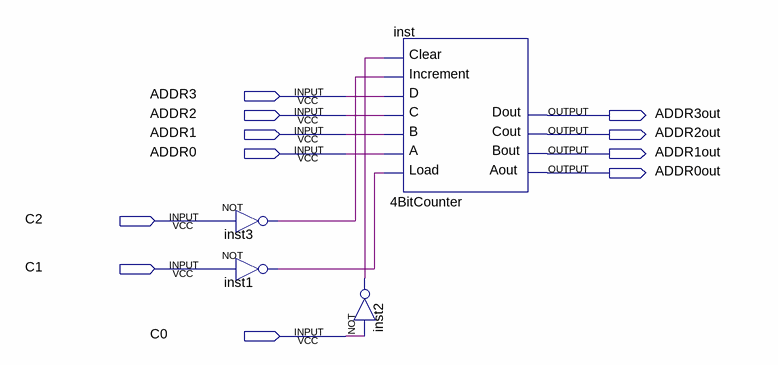
[diagram p0: schematic sheet]
// Quartus schematic PC.bdf as structural Verilog: 4 symbols, 11 pins
module PC (
  input  ADDR3,
  input  ADDR2,
  input  ADDR1,
  input  ADDR0,
  input  C2,
  input  C1,
  input  C0,
  output ADDR3out,
  output ADDR2out,
  output ADDR1out,
  output ADDR0out
);

  wire inst1_out, inst2_out, inst3_out;

  not inst3 (inst3_out, C2);
  not inst1 (inst1_out, C1);
  \4BitCounter  inst (
    .Load(inst1_out), .A(ADDR0), .B(ADDR1), .C(ADDR2), .D(ADDR3), .Increment(inst3_out), .Clear(inst2_out),
    .Aout(ADDR0out), .Bout(ADDR1out), .Cout(ADDR2out), .Dout(ADDR3out));
  not inst2 (inst2_out, C0);
endmodule
